# EAGLE schematic Schematic_control_panou (EAGLE 8.7.0)
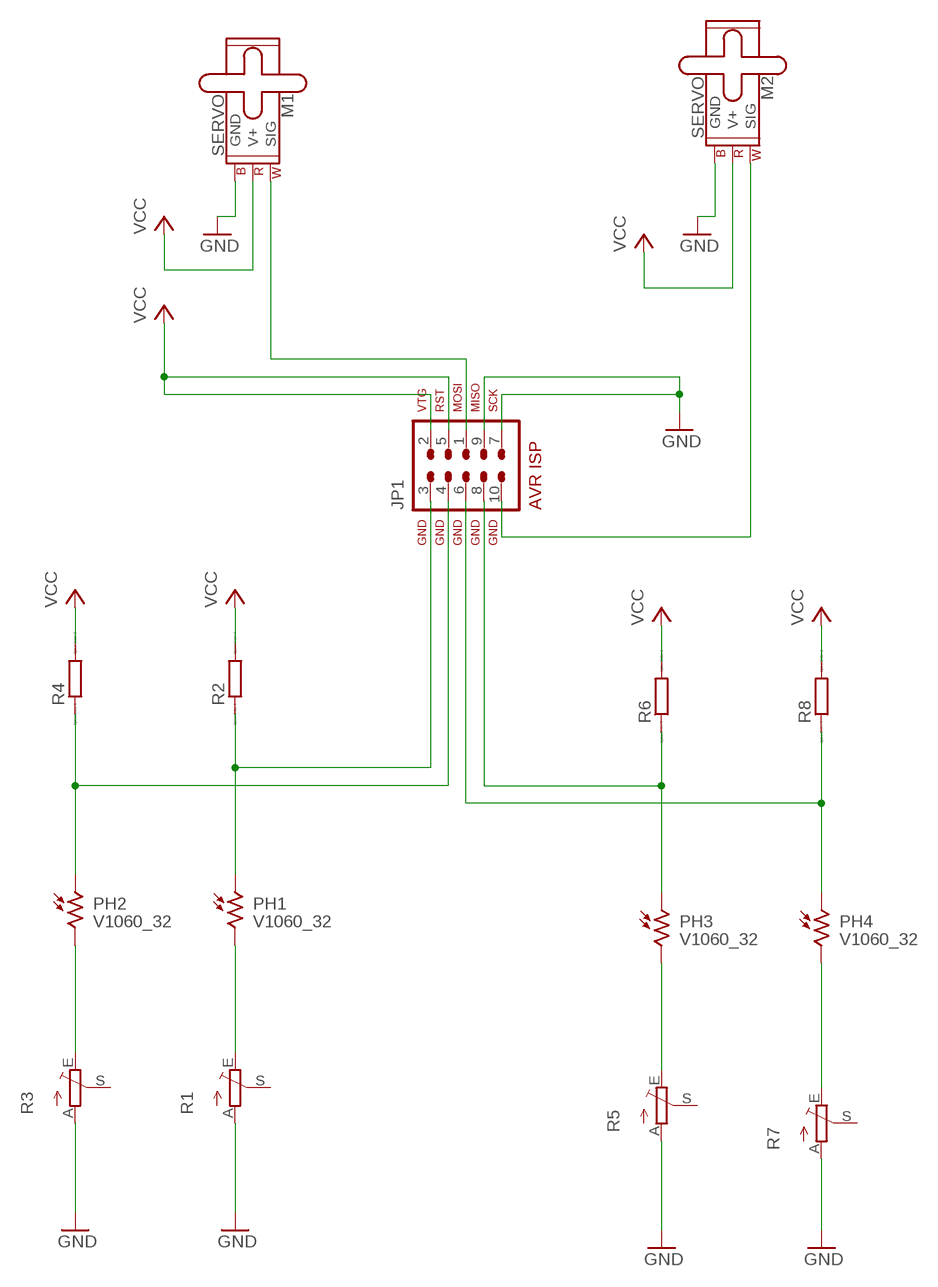
[diagram p0: schematic, sheet 1]

## Parts
JP1  AVR-ISP-10  [AVR-ISP-10]
M1  SERVO  [1X03]
M2  SERVO  [1X03]
PH1  V1060_32  [TO-5_V10]
PH2  V1060_32  [TO-5_V10]
PH3  V1060_32  [TO-5_V10]
PH4  V1060_32  [TO-5_V10]
R1  TRIM_EU-S64W  [S64W]
R2  R0207/10  [0207/10]
R3  TRIM_EU-S64W  [S64W]
R4  R0207/10  [0207/10]
R5  TRIM_EU-S64W  [S64W]
R6  R0207/10  [0207/10]
R7  TRIM_EU-S64W  [S64W]
R8  R0207/10  [0207/10]

## Nets
GND: JP1.7 JP1.9 M1.3(GND) M2.3(GND) R1.A R3.A R5.A R7.A
N$1: JP1.3 PH1.1 R2.1
N$2: PH1.2 R1.E
N$3: JP1.4 PH2.1 R4.1
N$4: PH2.2 R3.E
N$5: JP1.8 PH3.1 R6.1
N$6: PH3.2 R5.E
N$7: JP1.6 PH4.1 R8.1
N$8: PH4.2 R7.E
N$9: JP1.10 M2.1(SIG)
N$14: JP1.1 M1.1(SIG)
VCC: JP1.2 JP1.5 M1.2(V+) M2.2(V+) R2.2 R4.2 R6.2 R8.2
Unconnected: R1.S R3.S R5.S R7.S

## Library data of the parts
JP1 = avr-7:AVR-ISP-10: AVR ISP-10 Serial Programming Header
M1 M2 = SparkFun-Electromechanical:SERVO: Servo Motor 3-pin connector for a standard servo motor (voltage supply, ground, and control signal.) SparkFun Products Servo - Generic (Sub-Micro Size) <https://www.sparkfun.com/products/9065> (ROB-09065) Servo - Generic High Torque Continuous Rotation (Standard Size) <https://www.sparkfun.com/products/9347> (ROB-09347) Servo - Generic High Torque (Standard Size) <https://www.sparkfun.com/products/11965> (ROB-11965)
PH1-PH4 = photo-elements:?1060*: Sensor Street Light control Source: http://optoelectronics.perkinelmer.com/content/Datasheets/DTS_PhotocellsB1060.pdf
R1 R3 R5 R7 = pot:TRIM_EU-: POTENTIOMETER
R2 R4 R6 R8 = eagle-ltspice:R: RESISTOR, European symbol; SPICEMODEL: NONE; SPICEPREFIX: R